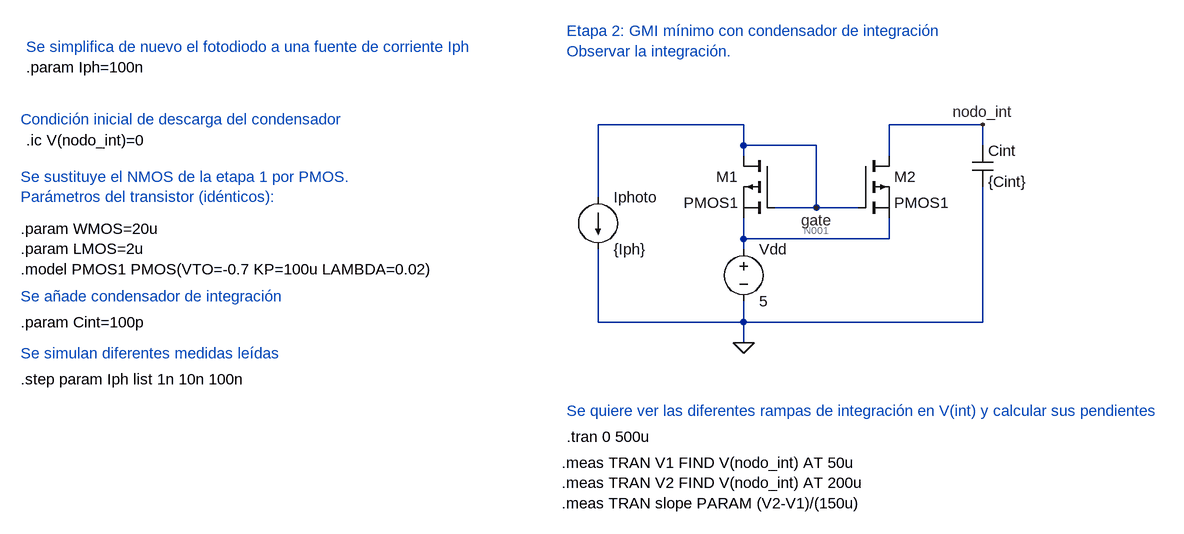
[diagram p0: schematic GMI_Etapa2.asc]
GMI_Etapa2.asc, the LTspice schematic file:
Version 4.1
SHEET 1 1112 816
WIRE 336 224 112 224
WIRE 704 224 560 224
WIRE 336 256 336 224
WIRE 448 256 336 256
WIRE 704 256 704 224
WIRE 336 272 336 256
WIRE 560 272 560 224
WIRE 112 336 112 224
WIRE 448 352 448 256
WIRE 448 352 384 352
WIRE 512 352 448 352
WIRE 336 400 336 368
WIRE 560 400 560 368
WIRE 560 400 336 400
WIRE 336 416 336 400
WIRE 112 528 112 416
WIRE 336 528 336 496
WIRE 336 528 112 528
WIRE 704 528 704 320
WIRE 704 528 336 528
WIRE 336 560 336 528
FLAG 336 560 0
FLAG 704 224 nodo_int
FLAG 448 352 gate
SYMBOL voltage 336 400 R0
WINDOW 123 0 0 Left 0
WINDOW 39 0 0 Left 0
SYMATTR InstName Vdd
SYMATTR Value 5
SYMBOL current 112 336 R0
SYMATTR InstName Iphoto
SYMATTR Value {Iph}
SYMBOL cap 688 256 R0
SYMATTR InstName Cint
SYMATTR Value {Cint}
SYMBOL pmos 512 272 R0
SYMATTR InstName M2
SYMATTR Value PMOS1
SYMATTR SpiceLine L={LMOS} W={WMOS}
SYMBOL pmos 384 272 M0
SYMATTR InstName M1
SYMATTR Value PMOS1
SYMATTR SpiceLine L={LMOS} W={WMOS}
TEXT 64 80 Left 2 ;Etapa 2: GMI mínimo con condensador de integración\nObservar la integración.
TEXT -776 384 Left 2 !.param WMOS=20u\n.param LMOS=2u\n.model PMOS1 PMOS(VTO=-0.7 KP=100u LAMBDA=0.02)
TEXT -776 616 Left 2 !.step param Iph list 1n 10n 100n
TEXT -776 304 Left 2 ;Se sustituye el NMOS de la etapa 1 por PMOS.\nParámetros del transistor (idénticos):
TEXT -768 104 Left 2 ;Se simplifica de nuevo el fotodiodo a una fuente de corriente Iph
TEXT -768 136 Left 2 !.param Iph=100n
TEXT -776 576 Left 2 ;Se simulan diferentes medidas leídas
TEXT 64 704 Left 2 !.tran 0 500u
TEXT -776 488 Left 2 ;Se añade condensador de integración
TEXT -776 528 Left 2 !.param Cint=100p
TEXT 56 744 Left 2 !.meas TRAN V1 FIND V(nodo_int) AT 50u\n.meas TRAN V2 FIND V(nodo_int) AT 200u\n.meas TRAN slope PARAM (V2-V1)/(150u)
TEXT 64 664 Left 2 ;Se quiere ver las diferentes rampas de integración en V(int) y calcular sus pendientes
TEXT -768 248 Left 2 !.ic V(nodo_int)=0
TEXT -776 216 Left 2 ;Condición inicial de descarga del condensador

The netlist it stands for:
* GMI_Etapa2.asc
Vdd N001 0 5
Iphoto gate 0 {Iph}
Cint nodo_int 0 {Cint}
M2 nodo_int gate N001 N001 PMOS1 L={LMOS} W={WMOS}
M1 gate gate N001 N001 PMOS1 L={LMOS} W={WMOS}
.model NMOS NMOS
.model PMOS PMOS
.lib standard.mos
* Etapa 2: GMI mínimo con condensador de integración
* Observar la integración.
.param WMOS=20u
.param LMOS=2u
.model PMOS1 PMOS(VTO=-0.7 KP=100u LAMBDA=0.02)
.step param Iph list 1n 10n 100n
* Se sustituye el NMOS de la etapa 1 por PMOS.
* Parámetros del transistor (idénticos):
* Se simplifica de nuevo el fotodiodo a una fuente de corriente Iph
.param Iph=100n
* Se simulan diferentes medidas leídas
.tran 0 500u
* Se añade condensador de integración
.param Cint=100p
.meas TRAN V1 FIND V(nodo_int) AT 50u
.meas TRAN V2 FIND V(nodo_int) AT 200u
.meas TRAN slope PARAM (V2-V1)/(150u)
* Se quiere ver las diferentes rampas de integración en V(int) y calcular sus pendientes
.ic V(nodo_int)=0
* Condición inicial de descarga del condensador
.backanno
.end

* Results of the author's LTspice run, read from the files saved beside the schematic
* Operating Point (first step), zero values left out:
*   V(gate) = 4.298 V
*   V(n001) = 5 V
*   I(Iphoto) = 1 nA
*   I(Vdd) = -2.094 nA
*   Ib(M2) = 5.01 pA
*   Id(M1) = -2.885 nA
*   Id(M2) = -3.138 nA
*   Is(M1) = 2.884 nA
*   Is(M2) = 3.133 nA
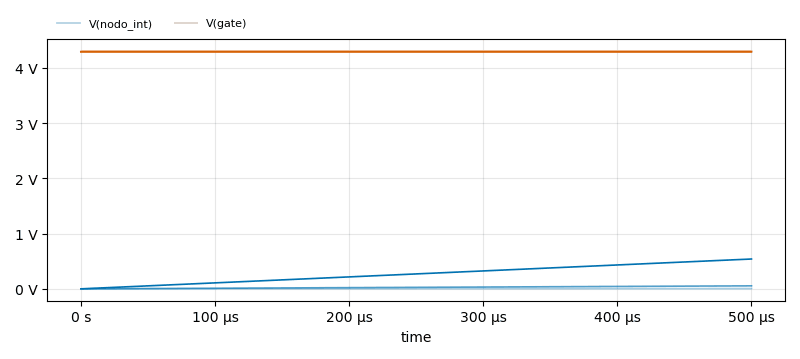
[diagram p1: Transient Analysis of GMI_Etapa2.asc, plotted from the saved traces]
* Transient Analysis, 3 runs:
*   V(nodo_int) [iph=1e-09]: min 0 V, max 5.466 mV, average 2.733 mV, rms 3.156 mV, last 5.466 mV
*   V(nodo_int) [iph=1e-08]: min 0 V, max 54.25 mV, average 27.13 mV, rms 31.33 mV, last 54.25 mV
*   V(nodo_int) [iph=1e-07]: min 0 V, max 539.6 mV, average 270.3 mV, rms 311.9 mV, last 539.6 mV
*   V(gate) [iph=1e-09]: min 4.298 V, max 4.299 V, average 4.299 V, rms 4.299 V, last 4.299 V
*   V(gate) [iph=1e-08]: min 4.294 V, max 4.296 V, average 4.296 V, rms 4.296 V, last 4.296 V
*   V(gate) [iph=1e-07]: min 4.286 V, max 4.286 V, average 4.286 V, rms 4.286 V, last 4.286 V
* From the log:
*   Measurement: v1
*     step  V(nodo_int)   at
*        1  0.000546627024902  5e-05
*        2  0.00542755316568  5e-05
*        3  0.0542030873055  5e-05
*   Measurement: v2
*     step  V(nodo_int)   at
*        1  0.00218647253547  0.0002
*        2  0.0217069701461  0.0002
*        3  0.216491751556  0.0002
*   Measurement: slope
*     step  (V2-V1)/(150u)
*        1  10.9323034038
*        2  108.529446536
*        3  1081.92442834